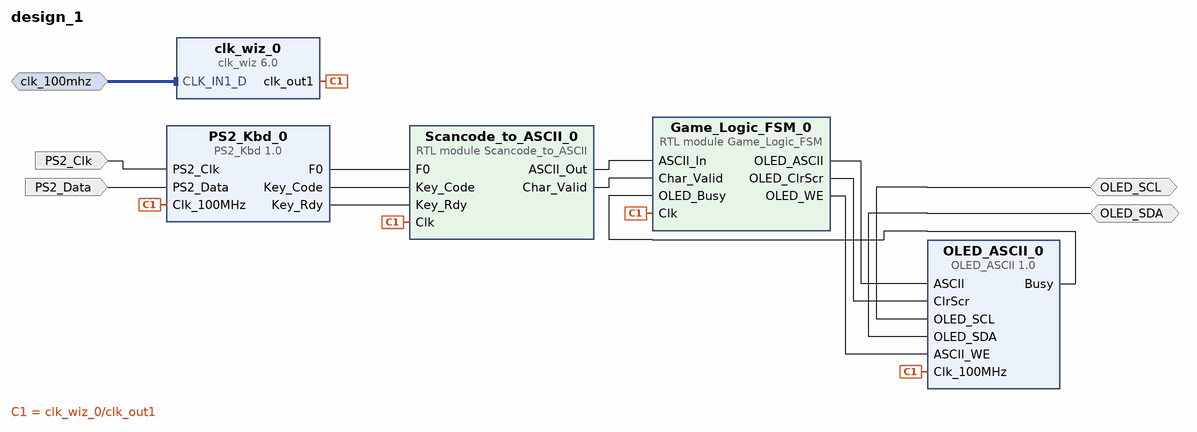
[diagram p0: block diagram of the top level]
# Vivado block design design_1, xczu3eg-sfvc784-2-e, Vivado 2025.1
create_bd_design design_1

create_bd_intf_port -mode Slave -vlnv xilinx.com:interface:diff_clock_rtl:1.0 clk_100mhz
set_property -dict {CONFIG.FREQ_HZ 100000000} [get_bd_intf_ports clk_100mhz]
create_bd_port -dir I PS2_Clk
create_bd_port -dir I PS2_Data
create_bd_port -dir IO OLED_SDA
create_bd_port -dir IO OLED_SCL

create_bd_cell -type ip -vlnv JS_WUST:UCiSW:PS2_Kbd:1.0 PS2_Kbd_0
create_bd_cell -type ip -vlnv JS_WUST:UCiSW:OLED_ASCII:1.0 OLED_ASCII_0
create_bd_cell -type module -reference Game_Logic_FSM Game_Logic_FSM_0
create_bd_cell -type ip -vlnv xilinx.com:ip:clk_wiz:6.0 clk_wiz_0
set_property -dict {CONFIG.CLK_IN1_BOARD_INTERFACE clk_100mhz CONFIG.USE_BOARD_FLOW true} [get_bd_cells clk_wiz_0]
create_bd_cell -type module -reference Scancode_to_ASCII Scancode_to_ASCII_0

# ---- connections ----

connect_bd_intf_net [get_bd_intf_ports clk_100mhz] [get_bd_intf_pins clk_wiz_0/CLK_IN1_D]
connect_bd_net [get_bd_pins Game_Logic_FSM_0/OLED_ASCII] [get_bd_pins OLED_ASCII_0/ASCII]
connect_bd_net [get_bd_pins Game_Logic_FSM_0/OLED_ClrScr] [get_bd_pins OLED_ASCII_0/ClrScr]
connect_bd_net [get_bd_pins Game_Logic_FSM_0/OLED_WE] [get_bd_pins OLED_ASCII_0/ASCII_WE]
connect_bd_net [get_bd_ports OLED_SDA] [get_bd_pins OLED_ASCII_0/OLED_SDA]
connect_bd_net [get_bd_ports OLED_SCL] [get_bd_pins OLED_ASCII_0/OLED_SCL]
connect_bd_net [get_bd_pins OLED_ASCII_0/Busy] [get_bd_pins Game_Logic_FSM_0/OLED_Busy]
connect_bd_net [get_bd_ports PS2_Clk] [get_bd_pins PS2_Kbd_0/PS2_Clk]
connect_bd_net [get_bd_ports PS2_Data] [get_bd_pins PS2_Kbd_0/PS2_Data]
connect_bd_net [get_bd_pins PS2_Kbd_0/F0] [get_bd_pins Scancode_to_ASCII_0/F0]
connect_bd_net [get_bd_pins PS2_Kbd_0/Key_Code] [get_bd_pins Scancode_to_ASCII_0/Key_Code]
connect_bd_net [get_bd_pins PS2_Kbd_0/Key_Rdy] [get_bd_pins Scancode_to_ASCII_0/Key_Rdy]
connect_bd_net [get_bd_pins Scancode_to_ASCII_0/ASCII_Out] [get_bd_pins Game_Logic_FSM_0/ASCII_In]
connect_bd_net [get_bd_pins Scancode_to_ASCII_0/Char_Valid] [get_bd_pins Game_Logic_FSM_0/Char_Valid]
connect_bd_net [get_bd_pins clk_wiz_0/clk_out1] \
  [get_bd_pins PS2_Kbd_0/Clk_100MHz] [get_bd_pins OLED_ASCII_0/Clk_100MHz] [get_bd_pins Game_Logic_FSM_0/Clk] \
  [get_bd_pins Scancode_to_ASCII_0/Clk]

validate_bd_design
save_bd_design
